# EAGLE design Arduino-WX-remote (EAGLE 5.11)
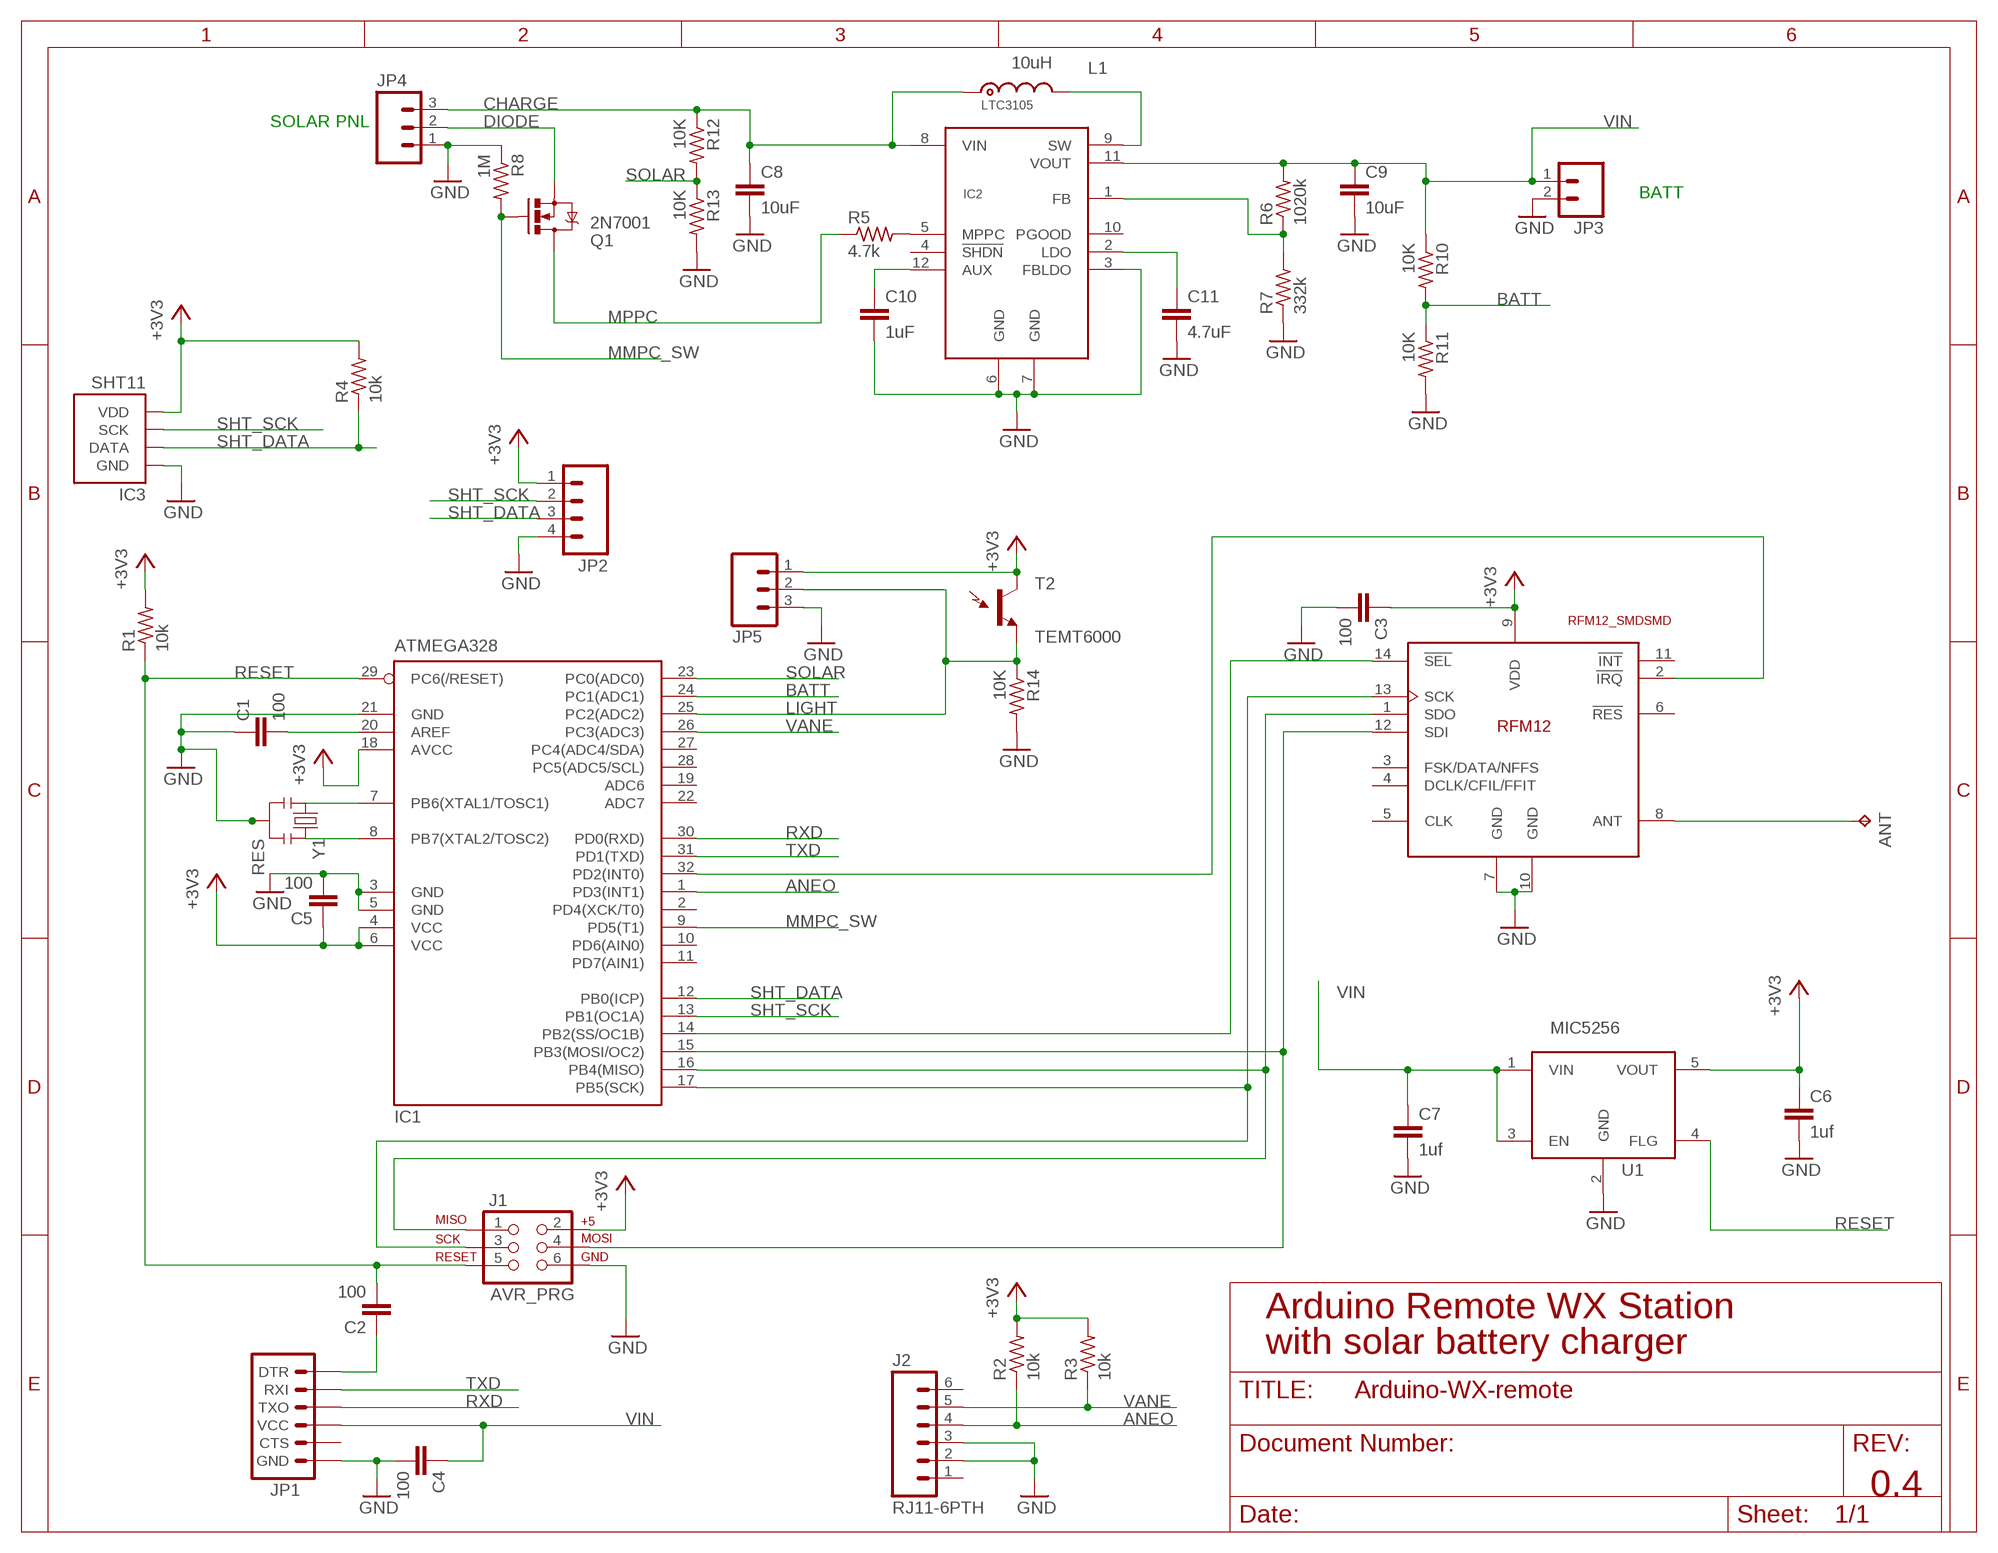
[diagram p0: schematic, sheet 1]

## Parts
ANT  TPB1,27  [B1,27]
C1  100  CAP0603-CAP  [0603-CAP]
C2  100  CAP0603-CAP  [0603-CAP]
C3  100  CAP0603-CAP  [0603-CAP]
C4  100  CAP0603-CAP  [0603-CAP]
C5  100  CAP0603-CAP  [0603-CAP]
C6  1uf  CAP0603-CAP  [0603-CAP]
C7  1uf  CAP0603-CAP  [0603-CAP]
C8  10uF  CAP1210  [1210]
C9  10uF  CAP1210  [1210]
C10  1uF  CAP1210  [1210]
C11  4.7uF  CAP1210  [1210]
IC1  ATMEGA328  MEGA8-AI  [TQFP32-08]
IC2  LTC3105  LTC1305  [MSOP12]
IC3  SHT11  SHT1XSMD  [SHT1X]
J1  AVR_PRG  AVR_SPI_PRG_6NS  [2X3-NS]
J2  RJ11-6PTH  [RJ11-6]
JP1  ARDUINO_SERIAL_PROGRAMPTH  [1X06]
JP2  M04PTH  [1X04]
JP3  M02PTH  [1X02]
JP4  M03PTH  [1X03]
JP5  M03PTH  [1X03]
L1  10uH  LDS0705  [LDS0705]
Q1  2N7001  MOSFET-NCHANNELSMD  [SOT23-3]
R1  10k  R-US_R0603  [R0603]
R2  10k  R-US_R0603  [R0603]
R3  10k  R-US_R0603  [R0603]
R4  10k  R-US_R0603  [R0603]
R5  4.7k  R-US_R0603  [R0603]
R6  1020k  R-US_R0603  [R0603]
R7  332k  R-US_R0603  [R0603]
R8  1M  R-US_R0603  [R0603]
R10  10K  R-US_R0603  [R0603]
R11  10K  R-US_R0603  [R0603]
R12  10K  R-US_R0603  [R0603]
R13  10K  R-US_R0603  [R0603]
R14  10K  R-US_R0603  [R0603]
T2  TEMT6000  [TEMT6000-SEN]
U1  MIC5256  [SOT-23-5]
U$1  RFM12_SMDSMD  [RFM12]
Y1  RES  RESONATORPTH  [RESONATOR-PTH]

## Nets
+3V3 [SUPPLY]: C3.1 C5.1 C6.1 IC1.4(VCC) IC1.6(VCC) IC1.18(AVCC) IC3.4(VDD) J1.2 JP2.1 JP5.1 R1.2 R2.2 R3.2 R4.2 T2.COLLECTOR(C1) U1.5(VOUT) U$1.9(VDD)
ANEO: IC1.1(PD3(INT1)) J2.4 R2.1
BATT: IC1.24(PC1(ADC1)) R10.2 R11.1
CHARGE [SUPPLY]: C8.1 IC2.8(VIN) JP4.3 L1.P$1 R12.1
DIODE: JP4.2 Q1.2(S)
GND: C1.1 C3.2 C4.2 C5.2 C6.2 C7.2 C8.2 C9.2 C10.2 C11.2 IC1.3(GND) IC1.5(GND) IC1.21(GND) IC2.3(FBLDO) IC2.6(GND) IC2.7(GND) IC3.1(GND) J1.6 J2.2 J2.3 JP1.6(GND) JP2.4 JP3.2 JP4.1 JP5.3 R7.1 R8.1 R11.2 R13.2 R14.2 U1.2(GND) U$1.7(GND) U$1.10(GND) Y1.2
LIGHT: IC1.25(PC2(ADC2)) JP5.2 R14.1 T2.EMITTER(E1)
MMPC_SW: IC1.9(PD5(T1)) Q1.1(G) R8.2
MPPC: Q1.3(D) R5.1
N$1: C2.1 JP1.1(DTR)
N$2: IC2.9(SW) L1.P$2
N$3: IC1.14(PB2(SS/OC1B)) U$1.14(!SEL)
N$4: IC1.17(PB5(SCK)) J1.3 U$1.13(SCK)
N$5: IC1.16(PB4(MISO)) J1.1 U$1.1(SDO)
N$6: IC1.15(PB3(MOSI/OC2)) J1.4 U$1.12(SDI)
N$7: IC1.32(PD2(INT0)) U$1.2(!IRQ)
N$8: C1.2 IC1.20(AREF)
N$9: IC2.5(MPPC) R5.2
N$10: IC1.7(PB6(XTAL1/TOSC1)) Y1.1
N$11: IC1.8(PB7(XTAL2/TOSC2)) Y1.3
N$12: C10.1 IC2.12(AUX)
N$13: ANT.TP U$1.8(ANT)
N$15: C11.1 IC2.2(LDO)
N$17: IC2.1(FB) R6.1 R7.2
RESET: C2.2 IC1.29(PC6(/RESET)) J1.5 R1.1 U1.4(FLG)
RXD: IC1.30(PD0(RXD)) JP1.3(TXO)
SHT_DATA: IC1.12(PB0(ICP)) IC3.2(DATA) JP2.3 R4.1
SHT_SCK: IC1.13(PB1(OC1A)) IC3.3(SCK) JP2.2
SOLAR: IC1.23(PC0(ADC0)) R12.2 R13.1
TXD: IC1.31(PD1(TXD)) JP1.2(RXI)
VANE: IC1.26(PC3(ADC3)) J2.5 R3.1
VIN [SUPPLY]: C4.1 C7.1 C9.1 IC2.11(VOUT) JP1.4(VCC) JP3.1 R6.2 R10.1 U1.1(VIN) U1.3(EN)
Unconnected: IC1.2(PD4(XCK/T0)) IC1.10(PD6(AIN0)) IC1.11(PD7(AIN1)) IC1.19(ADC6) IC1.22(ADC7) IC1.27(PC4(ADC4/SDA)) IC1.28(PC5(ADC5/SCL)) IC2.4(!SHDN!) IC2.10(PGOOD) J2.1 J2.6 JP1.5(CTS) U$1.3(FSK/DATA/NFFS) U$1.4(DCLK/CFIL/FFIT) U$1.5(CLK) U$1.6(!RES) U$1.11(!INT)

## Notes on the sheet
- SOLAR PNL
- BATT
- Arduino Remote WX Station
- with solar battery charger
- 0.4

## Library data of the parts
ANT = testpad:TP: Test pad
C1-C11 = SparkFun:CAP: Capacitor Standard 0603 ceramic capacitor, and 0.1" leaded capacitor.
IC1 = atmel:MEGA8: MICROCONTROLLER 8 Kbytes FLASH, 1 kbytes SRAM, 512 bytes EEPROM, USART, 6-channel 10 bit ADC, 2-channel 8 bit ADC Pin compatible with Atmega48, ATMega88, ATMega168 Source: avr.lbr
IC2 = mlucia:LTC1305: 400mA Step-Up DC/DC Converter with Maximum Power Point Control and 250mV Start-Up FEATURES DESCRIPTION 400mA Step-Up DC/DC Converter with Maximum Power Point Control and 250mV Start-Up The LTC®3105 is a high efficiency step-up DC/DC converter that can operate from input voltages as low as 225mV. A 250mV start-up capability and integrated maximum power point controller (MPPC) enable operation directly from low voltage, high impedance alternative power sources such as photovoltaic cells, TEGs (thermoelectric generators) and fuel cells. A user programmable MPPC set point maximizes the energy that can be extracted from any power source. Burst Mode operation, with a proprietary self adjusting peak current, optimizes converter efficiency and output voltage ripple over all operating conditions. The AUX powered 6mA LDO provides a regulated rail for external microcontrollers and sensors while the main output is charging. In shutdown, IQ is reduced to 10?A and integrated thermal shutdown offers protection from overtemperature faults. The LTC3105 is offered in 10-lead 3mm × 3mm × 0.75mm DFN and 12-lead MSOP packages. Output Current vs Input Voltage
IC3 = SparkFun:SHT1X: SHT1x Humdity Sensor Sensirion humdity sensor. Schematic element and footprint proven. Spark Fun Electronics SKU : COM-08227
J1 = SparkFun:AVR_SPI_PRG_6: AVR ISP 6 Pin This is the reduced ISP connector for AVR programming. Common on Arduino. This footprint will take up less PCB space and can be used with a 10-pin to 6-pin adapter such as SKU: BOB-08508
J2 = SparkFun:RJ11-6: RJ11 Jack Simple 6 pin RJ11 jack. Commonly found on CAT3 devices and Microchip programmers. SKU: PRT-00132
JP1 = SparkFun:ARDUINO_SERIAL_PROGRAM
JP2 = SparkFun:M04: Header 4 Standard 4-pin 0.1" header. Use with straight break away headers (SKU : PRT-00116), right angle break away headers (PRT-00553), swiss pins (PRT-00743), machine pins (PRT-00117), and female headers (PRT-00115). Molex polarized connector foot print use with SKU : PRT-08231 with associated crimp pins and housings. 1MM SMD Version SKU: PRT-10208
JP3 = SparkFun:M02: Header 2 Standard 2-pin 0.1" header. Use with straight break away headers (SKU : PRT-00116), right angle break away headers (PRT-00553), swiss pins (PRT-00743), machine pins (PRT-00117), and female headers (PRT-00115). Molex polarized connector foot print use with SKU : PRT-08233 with associated crimp pins and housings.
JP4 JP5 = SparkFun:M03: Header 3 Standard 3-pin 0.1" header. Use with straight break away headers (SKU : PRT-00116), right angle break away headers (PRT-00553), swiss pins (PRT-00743), machine pins (PRT-00117), and female headers (PRT-00115). Molex polarized connector foot print use with SKU : PRT-08232 with associated crimp pins and housings.
L1 = mlucia:LDS0705: LDS0705 Series Shielded Power Inductors: Description 125°C maximum temperature operation 7.8mm x 7.0mm x 5.0mm shielded drum core Ferrite core material Metalized core mounting utilizes board space Inductance range from 0.82?H to 470?H Current range from 8.57 Amps to 0.368 Amps Frequency range up to 1MHz
Q1 = SparkFun:MOSFET-NCHANNEL
R1-R8 R10-R14 = rcl:R-US_: RESISTOR, American symbol
T2 = SparkFun:TEMT6000: Ambient Light Sensor Simple light detection sensor. Output varies with light intensity input. Spark Fun Electronics SKU : COM-08348
U1 = mlucia:MIC5256
U$1 = rfm_12:RFM12_SMD: RFM12 is a low costing ISM band transceiver module implemented with unique PLL. It works signal ranges from 315/433/868/915MHZ bands, comply with FCC, ETSI regulation. The SPI interface is used to communicate with microcontroller for parameter setting.
Y1 = SparkFun:RESONATOR: Resonator Small SMD resonator. This is the itty bitty 10/20MHz resonators with built in caps. CSTCE10M0G55 and CSTCE20M0V53. Footprint has been reviewed closely but hasn't been tested yet.

## Net classes
1 SUPPLY: width 0.305 mm

## Board
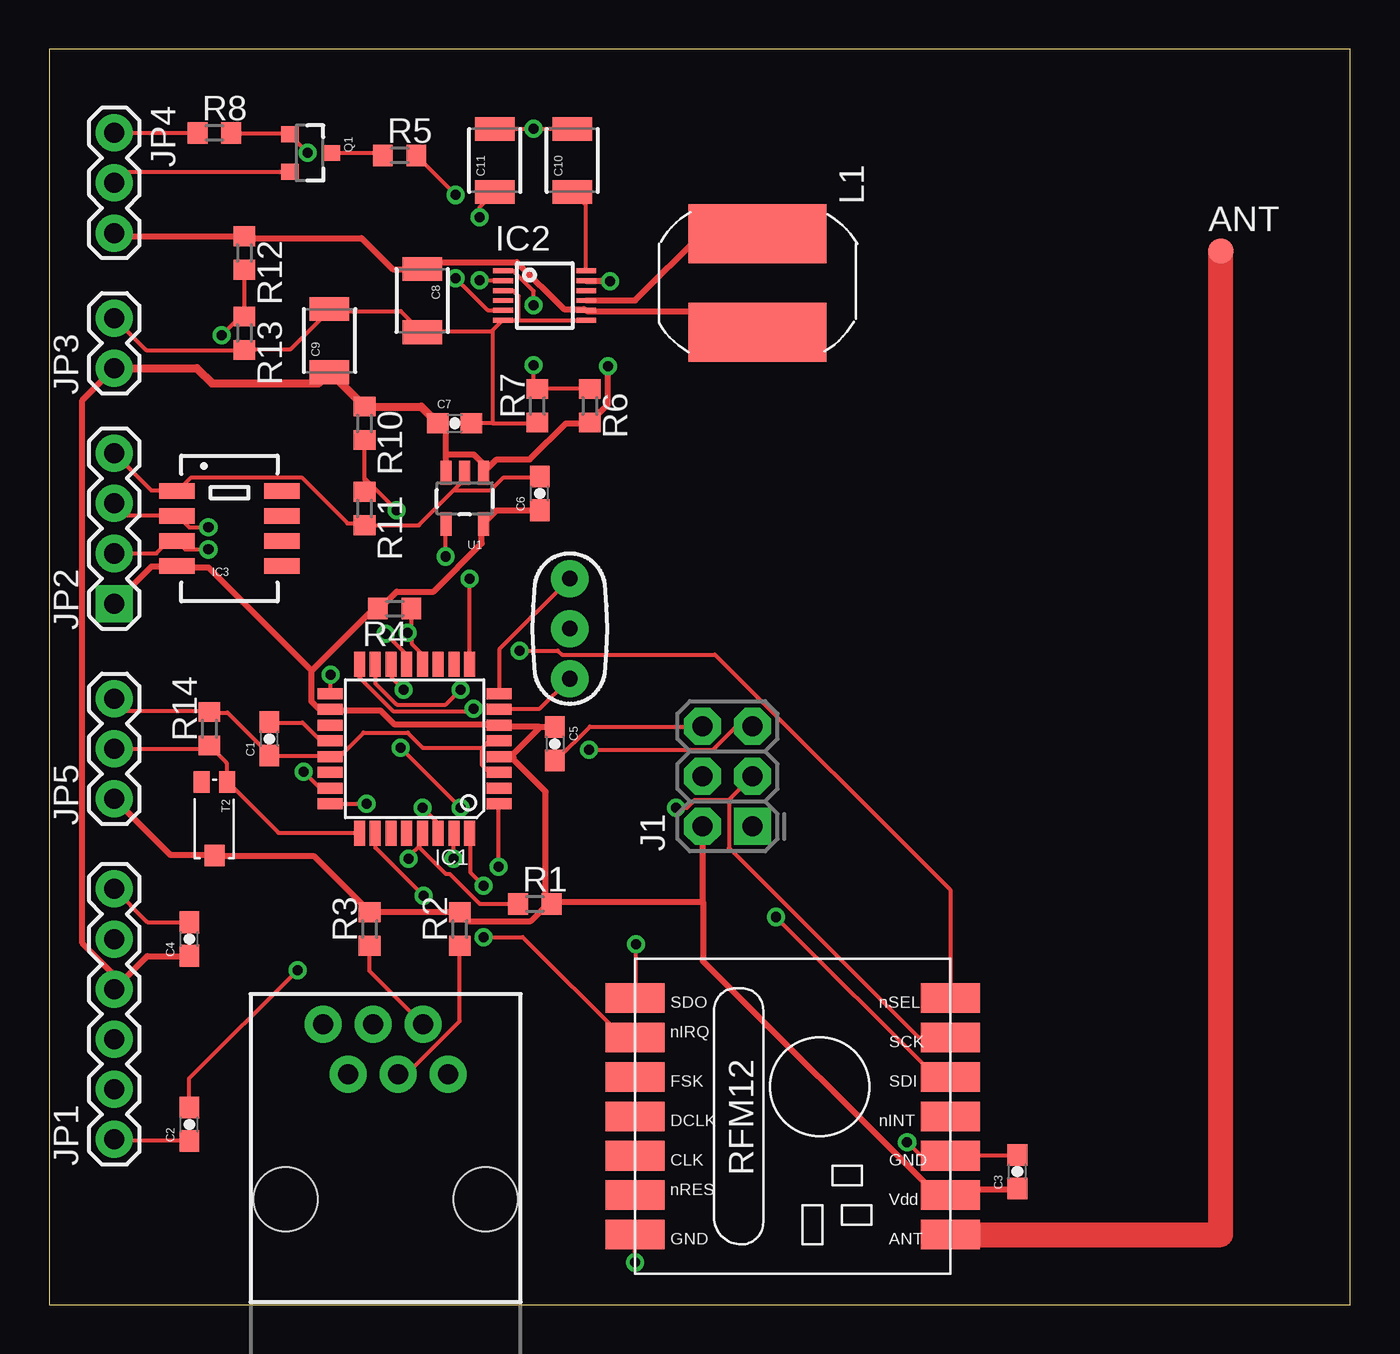
[diagram p1: board, top side]
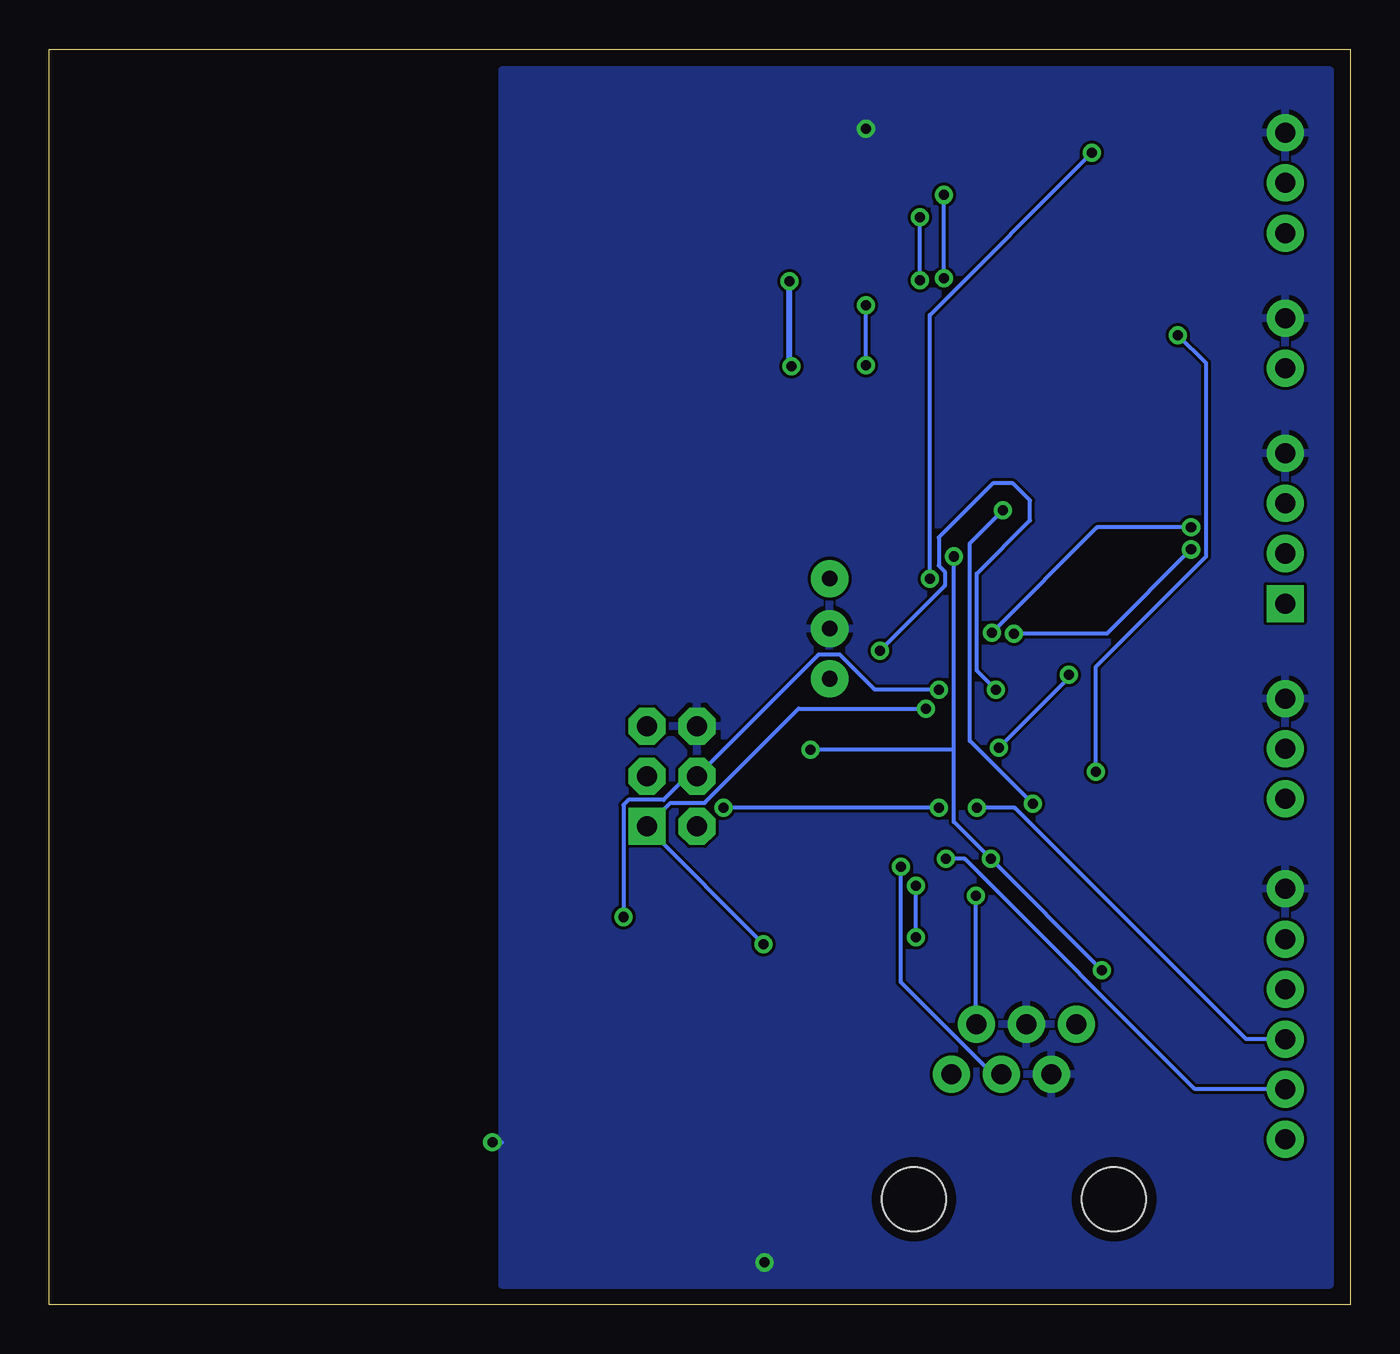
[diagram p2: board, bottom side, seen from below]

Size 66.02 x 63.68 mm. Coordinates in mm from the lower left corner, seen from the top.
Outline: 0,0 66.02,0 66.02,63.68 0,63.68 0,0
Copper layers (1*16): Top 0.035mm / dielectric 1.5mm / Bottom 0.035mm
Design rules "BatchPCB-2-layer *": minimum track width 8mil, minimum drill 20mil, track to track 6mil, track to pad 6mil, pad to pad 8mil, via to via 8mil, smd to smd 8mil, copper to edge 20mil, drill to drill 8mil, minimum pad ring 10mil, minimum via ring 8mil, stop-mask expansion 4mil, vias tented up to drill 0mil, thermal gap 10mil

### Footprints (pad centres in the part's own frame; a part is rotated, then mirrored left to right if it is on the bottom)
B1,27 = smd 1.27 x 1.27: TP 0,0
0603-CAP = smd 1.1 x 1: 1 -0.85,0; 2 0.85,0
1210 = smd 1.2 x 2: 1 -1.6,0; 2 1.6,0
TQFP32-08 = smd 1.27 x 0.559: 1 -4.293,2.8; 2 -4.293,2; 3 -4.293,1.2; 4 -4.293,0.4; 5 -4.293,-0.4; 6 -4.293,-1.2; 7 -4.293,-2; 8 -4.293,-2.8; 17 4.293,-2.8; 18 4.293,-2; 19 4.293,-1.2; 20 4.293,-0.4; 21 4.293,0.4; 22 4.293,1.2; 23 4.293,2; 24 4.293,2.8 | smd 0.559 x 1.27: 9 -2.8,-4.293; 10 -2,-4.293; 11 -1.2,-4.293; 12 -0.4,-4.293; 13 0.4,-4.293; 14 1.2,-4.293; 15 2,-4.293; 16 2.8,-4.293; 25 2.8,4.293; 26 2,4.293; 27 1.2,4.293; 28 0.4,4.293; 29 -0.4,4.293; 30 -1.2,4.293; 31 -2,4.293; 32 -2.8,4.293
MSOP12 = smd 1 x 0.25: 1 -2.24,1.127; 2 -2.24,0.627; 3 -2.24,0.127; 4 -2.24,-0.373; 5 -2.24,-0.873; 6 -2.24,-1.381; 7 1.986,-1.381; 8 1.986,-0.873; 9 1.986,-0.373; 10 1.986,0.127; 11 1.986,0.627; 12 1.986,1.127
SHT1X = smd 1.8 x 0.8: 1 -2.667,1.905; 2 -2.667,0.635; 3 -2.667,-0.635; 4 -2.667,-1.905; 5 2.667,-1.905; 6 2.667,-0.635; 7 2.667,0.635; 8 2.667,1.905
2X3-NS = drill 1.016 pad 1.88 square: 1 -2.54,-1.27 | drill 1.016 pad 1.88 octagon: 2 -2.54,1.27; 3 0,-1.27; 4 0,1.27; 5 2.54,-1.27; 6 2.54,1.27
RJ11-6 = drill 1.016 pad 1.88 round: 1 1.905,8.89; 2 3.175,6.35; 3 4.445,8.89; 4 5.715,6.35; 5 6.985,8.89; 6 8.255,6.35 | hole 3.251: 0,0; 10.16,0
1X06 = drill 1.016 pad 1.88 round: 1 0,0; 2 2.54,0; 3 5.08,0; 4 7.62,0; 5 10.16,0; 6 12.7,0
1X04 = drill 1.016 pad 1.88 square: 1 0,0 | drill 1.016 pad 1.88 round: 2 2.54,0; 3 5.08,0; 4 7.62,0
1X02 = drill 1.016 pad 1.88 round: 1 0,0; 2 2.54,0
1X03 = drill 1.016 pad 1.88 round: 1 0,0; 2 2.54,0; 3 5.08,0
LDS0705 = smd 3 x 7: P$1 -2.5,0; P$2 2.5,0
SOT23-3 = smd 0.8 x 0.9: 1 -0.95,-1; 2 0.95,-1; 3 0,1.1
R0603 = smd 1 x 1.1: 1 -0.85,0; 2 0.85,0
TEMT6000-SEN = smd 1.1 x 0.8: BASE -1.87,-0.65; EMITTER -1.87,0.65 | smd 1.1 x 1: COLLECTOR 1.86,0.01
SOT-23-5 = smd 0.55 x 1.2: 1 -0.95,-1.3; 2 0,-1.3; 3 0.95,-1.3; 4 0.95,1.3; 5 -0.95,1.3
RFM12 = smd 1.5 x 3: 1 -5,-10; 2 -3,-10; 3 -1,-10; 4 1,-10; 5 3,-10; 6 5,-10; 7 7,-10; 8 7,6; 9 5,6; 10 3,6; 11 1,6; 12 -1,6; 13 -3,6; 14 -5,6
RESONATOR-PTH = drill 0.8 pad 1.88 round: 1 -2.54,0; 2 0,0; 3 2.54,0

### Placement (x,y rotation side)
ANT  59.45,53.44 0 top
C1  11.18,28.7 90 top
C2  7.11,9.14 90 top
C3  49.13,6.74 90 top
C4  7.11,18.54 90 top
C5  25.65,28.45 270 top
C6  24.89,41.15 90 top
C7  20.57,44.7 0 top
C8  18.92,50.93 270 top
C9  14.22,48.9 90 top
C10  26.54,58.04 90 top
C11  22.61,58.04 90 top
IC1  18.54,28.19 180 top
IC2  25.27,51.31 0 top
IC3  9.14,39.37 0 top
J1  34.42,26.8 90 top
J2  11.99,5.33 0 top
JP1  3.3,8.38 90 top
JP2  3.3,35.56 90 top
JP3  3.3,47.5 90 top
JP4  3.3,59.44 270 top
JP5  3.3,25.65 90 top
L1  35.94,51.82 90 top
Q1  13.21,58.42 270 top
R1  24.64,20.32 0 top
R2  20.83,19.05 90 top
R3  16.26,19.05 90 top
R4  17.53,35.31 180 top
R5  17.78,58.29 0 top
R6  27.43,45.59 270 top
R7  24.77,45.59 90 top
R8  8.38,59.44 0 top
R10  16,44.7 270 top
R11  16,40.39 270 top
R12  9.91,53.34 270 top
R13  9.91,49.28 270 top
R14  8.13,29.21 90 top
T2  8.38,24.64 270 top
U1  21.08,40.89 180 top
U$1  39.73,10.55 270 top
Y1  26.42,34.29 90 top

### Tracks (layer width: path | path; a pad name or v marks a point on that pad's centre or on a via)
+3V3
  Top 0.305: C3.1 49.12,5.84 46.02,5.84 45.77,5.59 U$1.9 45.62,5.64 44.96,5.64 33.17,17.42 33.17,20.42 | 33.17,20.42 33.17,24.23 J1.2 | JP2.1 5.18,37.44 6.45,37.44 IC3.4 6.6,37.39 8.08,37.39 13.31,32.16 | C6.1 24.89,40.28 22.71,40.28 22.05,39.62 U1.5 21.95,39.47 21.95,38.61 19.51,36.17 17.63,36.17 16.82,35.36 R4.2 16.46,35.31 13.31,32.16 | 13.31,32.16 13.31,30.58 13.66,30.23 14.22,30.23 IC1.18 14.38,30.12 16.82,30.12 17.53,29.41 22.71,29.41 IC1.6 22.86,29.36 22.91,29.31 24.84,29.31 | JP5.1 6.15,22.81 8.38,22.81 T2.COLLECTOR 8.53,22.76 13.41,22.76 16.15,20.02 R3.2 16.26,19.91 20.83,19.91 R2.2 20.93,19.81 21.29,19.46 24.43,19.46 25.3,20.32 R1.2 | 24.84,29.31 25.65,29.31 C5.1 | 23.47,27.84 22.86,27.84 IC1.4 | 23.47,27.84 24.84,29.21 24.84,29.31 | 23.47,27.84 23.57,27.74 23.57,27.64 25.2,26.01 25.2,20.42 R1.2 | 33.17,20.42 25.6,20.42 R1.2
ANEO  (via drill 0.51)
  Top 0.203: R2.1 20.83,14.38 18.14,11.68 J2.4 | v22.81,22.2 22.81,25.35 IC1.1
  Bottom 0.203: v22.81,22.2 22.81,16.36 18.14,11.68 J2.4
BATT  (via drill 0.51)
  Top 0.203: 16,41.86 R11.1 | 16,41.86 R10.2 | v16.1,25.4 14.28,25.4 IC1.24 | v17.63,40.28 16.05,41.86 16,41.86
  Bottom 0.203: v16.1,25.4 19.3,28.6 19.3,38.61 v17.63,40.28
CHARGE
  Top 0.305: L1.P$1 35.92,49.33 34.85,50.39 27.28,50.39 IC2.8 27.13,50.49 26.11,50.49 23.72,52.88 19.36,52.88 19.05,52.58 C8.1 18.9,52.53 17.42,52.53 15.85,54.1 10.01,54.1 R12.1 9.91,54.2 3.45,54.2 JP4.3
DIODE
  Top 0.203: JP4.2 3.86,57.45 12.19,57.45 Q1.2
GND  (via drill 0.51)
  Top 0.203: 22.5,44.7 24.74,44.7 R7.1 | 22.5,44.7 C7.2 | 23.82,49.94 27.23,49.94 IC2.7 | 23.82,49.94 23.06,49.94 IC2.6 22.96,49.89 22.45,49.38 | IC2.3 23.06,51.41 23.57,51.41 23.82,51.16 23.82,49.94 | 22.45,49.38 18.95,49.38 C8.2 18.85,49.38 17.83,50.39 14.28,50.39 C9.2 14.22,50.44 12.24,48.46 9.91,48.46 R13.2 9.86,48.41 4.93,48.41 JP3.2 | 22.5,44.7 22.5,49.33 22.45,49.38 | 21.95,28.19 21.95,27.38 22.3,27.03 22.81,27.03 IC1.3 | 21.95,28.19 22.3,28.55 22.81,28.55 IC1.5 | 21.95,28.19 21.89,28.25 18.95,28.25 18.19,29.01 15.95,29.01 14.78,27.84 14.33,27.84 IC1.21 14.22,27.84 11.18,27.84 C1.1 11.12,27.94 9.04,30.02 8.13,30.02 R14.2 8.08,30.12 3.91,30.12 JP5.3 | 20.57,41.35 21.08,41.86 U1.2 | 20.57,41.35 18.75,39.52 16,39.52 R11.2 15.95,39.62 15.14,39.62 12.8,41.96 7.21,41.96 6.55,41.3 IC3.1 6.45,41.3 5.18,41.3 JP2.4 | C6.2 24.89,41.96 23.06,41.96 22.4,41.3 20.62,41.3 20.57,41.35 | C3.2 49.12,7.57 45.77,7.57 U$1.10 45.67,7.62 44.15,7.62 v43.54,8.23 | C11.2 v24.59,59.64 26.52,59.64 C10.2 | C11.2 | JP1.6 4.98,19.41 7.11,19.41 C4.2 | C5.2 25.65,27.64 25.76,27.64 27.43,29.31 33.12,29.31 J1.6 | JP4.1 R8.1 | v29.72,2.13 29.72,3.5 U$1.7
  Bottom 0.203: 43.05,8.23 v43.54,8.23
  pour Bottom: 1.02,62.61 43.05,62.61 43.05,1.02 1.02,1.02
LIGHT
  Top 0.203: IC1.25 15.7,23.93 11.63,23.93 9.09,26.47 T2.EMITTER 8.99,26.52 8.99,27.48 8.13,28.35 R14.1 8.18,28.19 JP5.2
MMPC_SW  (via drill 0.51)
  Top 0.203: R8.2 9.25,59.44 9.3,59.38 12.19,59.38 Q1.1 12.24,59.28 v13.11,58.42 | v21.34,36.83 21.34,32.51 IC1.9
  Bottom 0.203: v21.34,36.83 21.34,50.19 v13.11,58.42
MPPC
  Top 0.203: Q1.3 16.82,58.42 16.92,58.32 R5.1
N$1
  Top 0.203: JP1.1 3.35,8.33 7.11,8.33 C2.1
N$2
  Top 0.305: IC2.9 29.73,50.94 33.15,54.36 35.9,54.36 L1.P$2
N$3  (via drill 0.51)
  Top 0.203: v17.98,31.19 17.37,31.8 17.37,32.46 IC1.14 | v23.88,33.17 25.81,33.17 26.01,32.97 33.78,32.97 45.72,21.03 45.72,15.6 U$1.14
  Bottom 0.203: v17.98,31.19 18.95,32.16 18.95,37.08 16.26,39.78 16.26,40.79 17.12,41.66 18.14,41.66 20.88,38.91 20.88,37.49 20.57,37.19 20.57,36.47 v23.88,33.17
N$4  (via drill 0.51)
  Top 0.203: v14.28,31.95 14.28,31.04 IC1.17 | v17.83,28.25 v20.88,25.2 | v31.8,25.2 32.36,25.2 32.77,25.6 34.49,25.6 | 34.49,25.6 J1.3 | U$1.13 45.72,13.56 44.09,13.56 34.49,23.16 34.49,25.6
  Bottom 0.203: v14.28,31.95 14.28,31.8 v17.83,28.25 | v20.88,25.2 v31.8,25.2
N$5  (via drill 0.51)
  Top 0.203: v21.54,30.23 21.39,30.07 17.48,30.07 15.75,31.8 15.75,32.46 IC1.16 | v29.77,18.29 29.77,15.6 U$1.1
  Bottom 0.203: v21.54,30.23 27.99,30.23 32.77,25.45 34.49,25.45 J1.1 35.66,24.18 v29.77,18.29
N$6  (via drill 0.51)
  Top 0.203: v20.88,31.19 20.12,30.43 17.63,30.43 16.56,31.5 16.56,32.46 IC1.15 | v36.88,19.66 44.96,11.58 45.72,11.58 U$1.12
  Bottom 0.203: v20.88,31.19 24.13,31.19 25.91,32.97 26.98,32.97 J1.4 33.22,26.77 33.68,26.77 34.85,25.6 36.63,25.6 36.88,25.35 v36.88,19.66
N$7  (via drill 0.51)
  Top 0.203: v22.05,21.23 21.39,21.89 21.39,23.88 IC1.32 | v22.05,18.64 24.03,18.64 29.11,13.56 29.72,13.56 U$1.2
  Bottom 0.203: v22.05,18.64 v22.05,21.23
N$8
  Top 0.203: C1.2 11.18,29.52 12.85,29.52 13.77,28.6 14.22,28.6 IC1.20
N$9  (via drill 0.51)
  Top 0.203: v20.62,52.07 22.25,50.44 23.01,50.44 IC2.5 | v20.62,56.29 18.64,58.27 R5.2
  Bottom 0.203: v20.62,52.07 v20.62,56.29
N$10
  Top 0.203: Y1.1 24.89,30.23 22.86,30.23 IC1.7
N$11
  Top 0.203: Y1.3 22.86,33.27 22.86,31.04 IC1.8
N$12
  Top 0.203: IC2.12 27.23,52.48 27.23,55.78 26.57,56.44 C10.1
N$13
  Top 1.27: U$1.8 59.45,3.55 ANT.TP
N$15  (via drill 0.51)
  Top 0.203: v21.84,51.97 23.01,51.97 IC2.2 | v21.84,55.17 21.84,55.68 C11.1 | C11.1
  Bottom 0.203: v21.84,51.97 v21.84,55.17
N$17  (via drill 0.51)
  Top 0.203: v24.59,50.7 24.59,51.41 23.57,52.43 23.06,52.43 IC2.1 | 24.64,47.35 v24.59,47.65 24.59,46.63 24.74,46.48 R7.2 24.84,46.48 27.43,46.48 R6.1
  Bottom 0.203: v24.59,47.65 v24.59,50.7
RESET  (via drill 0.51)
  Top 0.203: v12.6,16.97 7.11,11.48 C2.2 | v18.24,22.61 18.24,22.71 18.75,23.22 | 18.75,23.22 18.9,23.37 18.9,23.88 IC1.29 | R1.1 21.84,20.32 20.32,21.84 20.12,21.84 18.75,23.22 | v20.12,37.95 20.12,39.57 U1.4 | v27.38,28.14 33.68,28.14 34.85,29.31 35.66,29.31 J1.5
  Bottom 0.203: v12.6,16.97 v18.24,22.61 20.12,24.49 20.12,28.14 | 20.12,28.14 v20.12,37.95 | 20.12,28.14 v27.38,28.14
RXD  (via drill 0.51)
  Top 0.203: v18.95,25.2 19.71,24.43 19.71,23.93 IC1.30
  Bottom 0.203: v18.95,25.2 17.02,25.2 5.28,13.46 JP1.3
SHT_DATA  (via drill 0.51)
  Top 0.203: 18.39,34.09 18.39,33.53 18.9,33.02 18.9,32.51 IC1.12 | 18.39,34.09 R4.1 | JP2.3 3.91,40.03 6.45,40.03 IC3.2 6.55,39.98 7.11,39.42 v8.08,39.42 | v18.19,34.09 18.39,34.09
  Bottom 0.203: v18.19,34.09 12.85,39.42 v8.08,39.42
SHT_SCK  (via drill 0.51)
  Top 0.203: v17.07,34.04 18.14,32.97 18.14,32.51 IC1.13 | v8.08,38.3 6.91,38.3 IC3.3 6.4,38.71 6.04,38.71 5.44,38.1 JP2.2
  Bottom 0.203: v17.07,34.04 12.34,34.04 v8.08,38.3
SOLAR  (via drill 0.51)
  Top 0.203: R12.2 R13.1 9.86,50.29 v8.74,49.17 | v12.9,27.03 13.72,26.21 14.22,26.21 IC1.23
  Bottom 0.203: v12.9,27.03 12.9,32.36 7.32,37.95 7.32,47.75 v8.74,49.17
TXD  (via drill 0.51)
  Top 0.203: v20.52,22.61 20.52,23.88 IC1.31
  Bottom 0.203: v20.52,22.61 19.56,22.61 7.87,10.92 JP1.2
VANE  (via drill 0.51)
  Top 0.203: R3.1 16.26,16.92 18.95,14.22 J2.5 | v19,20.73 16.56,23.16 16.56,23.88 IC1.26
  Bottom 0.203: v19,20.73 19,14.22 J2.5
VIN  (via drill 0.51)
  Top 0.305: C4.1 7.11,17.68 4.98,17.68 JP1.4 3.56,16.46 1.68,18.34 1.68,45.87 JP3.1 | v28.45,51.92 27.28,51.92 IC2.11 | 20.12,43.13 20.12,44.25 19.81,44.55 C7.1 | 20.12,43.13 20.12,42.22 U1.3 | 20.12,43.13 21.54,43.13 22.15,42.52 U1.1 22.05,42.22 22.71,42.88 24.38,42.88 26.21,44.7 27.43,44.7 R6.2 27.53,44.86 28.35,45.67 v28.35,47.6
  Top 0.406: JP3.1 7.49,47.5 8.26,46.74 13.66,46.74 C9.1 14.26,47.3 R10.1 18.87,45.55 C7.1
  Bottom 0.305: v28.45,51.92 28.45,47.7 v28.35,47.6